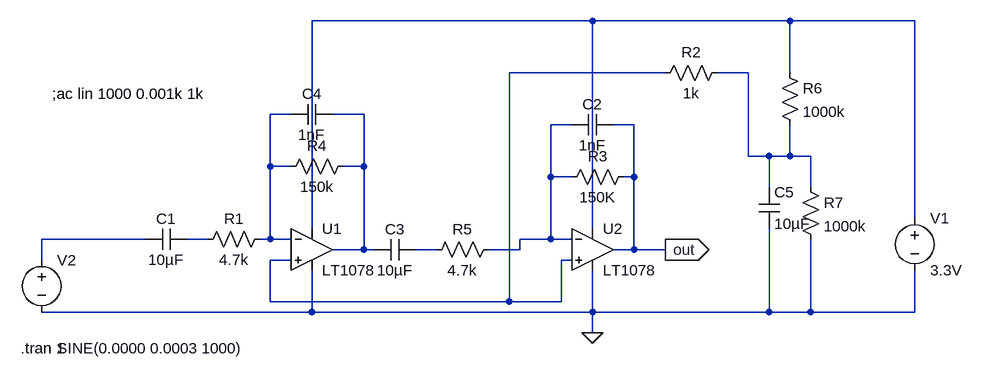
[diagram p0: schematic NFOpAmp.asc]
NFOpAmp.asc, the LTspice schematic file:
Version 4
SHEET 1 980 680
WIRE 400 -256 -32 -256
WIRE 704 -256 400 -256
WIRE 896 -256 704 -256
WIRE 512 -176 272 -176
WIRE 640 -176 592 -176
WIRE 704 -176 704 -256
WIRE -64 -112 -96 -112
WIRE 48 -112 0 -112
WIRE 368 -96 336 -96
WIRE 464 -96 432 -96
WIRE 640 -48 640 -176
WIRE 672 -48 640 -48
WIRE 704 -48 704 -96
WIRE 704 -48 672 -48
WIRE 736 -48 704 -48
WIRE -96 -32 -96 -112
WIRE -64 -32 -96 -32
WIRE 48 -32 48 -112
WIRE 48 -32 16 -32
WIRE 336 -16 336 -96
WIRE 368 -16 336 -16
WIRE 464 -16 464 -96
WIRE 464 -16 448 -16
WIRE 672 0 672 -48
WIRE 736 0 736 -48
WIRE 896 48 896 -256
WIRE -32 64 -32 -256
WIRE 400 64 400 -256
WIRE -320 80 -448 80
WIRE -288 80 -320 80
WIRE -192 80 -224 80
WIRE -96 80 -96 -32
WIRE -96 80 -112 80
WIRE -64 80 -96 80
WIRE 336 80 336 -16
WIRE 336 80 288 80
WIRE 368 80 336 80
WIRE 48 96 48 -32
WIRE 48 96 0 96
WIRE 64 96 48 96
WIRE 160 96 128 96
WIRE 288 96 288 80
WIRE 288 96 240 96
WIRE 464 96 464 -16
WIRE 464 96 432 96
WIRE 512 96 464 96
WIRE -448 112 -448 80
WIRE -64 112 -96 112
WIRE 368 112 352 112
WIRE -96 176 -96 112
WIRE 272 176 272 -176
WIRE 272 176 -96 176
WIRE 352 176 352 112
WIRE 352 176 272 176
WIRE -32 192 -32 128
WIRE -32 192 -448 192
WIRE 400 192 400 128
WIRE 400 192 -32 192
WIRE 672 192 672 64
WIRE 672 192 400 192
WIRE 736 192 736 80
WIRE 736 192 672 192
WIRE 896 192 896 128
WIRE 896 192 736 192
WIRE 400 224 400 192
FLAG 400 224 0
FLAG 512 96 out
IOPIN 512 96 Out
DATAFLAG -320 80 ""
SYMBOL voltage 896 32 R0
WINDOW 123 0 0 Left 2
WINDOW 39 0 0 Left 2
SYMATTR InstName V1
SYMATTR Value 3.3V
SYMBOL res -96 64 R90
WINDOW 0 0 56 VBottom 2
WINDOW 3 32 56 VTop 2
SYMATTR InstName R1
SYMATTR Value 4.7k
SYMBOL cap -224 64 R90
WINDOW 0 0 32 VBottom 2
WINDOW 3 32 32 VTop 2
SYMATTR InstName C1
SYMATTR Value 10µF
SYMBOL res 464 -32 R90
WINDOW 0 0 56 VBottom 2
WINDOW 3 32 56 VTop 2
SYMATTR InstName R3
SYMATTR Value 150K
SYMBOL cap 432 -112 R90
WINDOW 0 0 32 VBottom 2
WINDOW 3 32 32 VTop 2
SYMATTR InstName C2
SYMATTR Value 1nF
SYMBOL res 32 -48 R90
WINDOW 0 0 56 VBottom 2
WINDOW 3 32 56 VTop 2
SYMATTR InstName R4
SYMATTR Value 150k
SYMBOL cap 128 80 R90
WINDOW 0 0 32 VBottom 2
WINDOW 3 32 32 VTop 2
SYMATTR InstName C3
SYMATTR Value 10µF
SYMBOL res 256 80 R90
WINDOW 0 0 56 VBottom 2
WINDOW 3 32 56 VTop 2
SYMATTR InstName R5
SYMATTR Value 4.7k
SYMBOL cap 0 -128 R90
WINDOW 0 0 32 VBottom 2
WINDOW 3 32 32 VTop 2
SYMATTR InstName C4
SYMATTR Value 1nF
SYMBOL voltage -448 96 R0
WINDOW 123 24 124 Left 2
WINDOW 39 0 0 Left 2
WINDOW 3 24 152 Left 2
SYMATTR Value SINE(0.0000 0.0003 1000)
SYMATTR InstName V2
SYMBOL Opamps\\LT1078 -32 32 R0
SYMATTR InstName U1
SYMBOL Opamps\\LT1078 400 32 R0
SYMATTR InstName U2
SYMBOL res 688 -192 R0
SYMATTR InstName R6
SYMATTR Value 1000k
SYMBOL res 720 -16 R0
SYMATTR InstName R7
SYMATTR Value 1000k
SYMBOL cap 656 0 R0
SYMATTR InstName C5
SYMATTR Value 10µF
SYMBOL res 608 -192 R90
WINDOW 0 0 56 VBottom 2
WINDOW 3 32 56 VTop 2
SYMATTR InstName R2
SYMATTR Value 1k
TEXT -480 248 Left 2 !.tran 1
TEXT -432 -144 Left 2 !;ac lin 1000 0.001k 1k

The netlist it stands for:
* NFOpAmp.asc
V1 N001 0 3.3V
R1 N004 N008 4.7k
C1 N008 N007 10µF
R3 out N006 150K
C2 out N006 1nF
R4 N005 N004 150k
C3 N009 N005 10µF
R5 N006 N009 4.7k
C4 N005 N004 1nF
V2 N007 0 SINE(0.0000 0.0003 1000)
XU1 N002 N004 N001 0 N005 LT1078  ; pins In+ In- V+ V- OUT
XU2 N002 N006 N001 0 out LT1078  ; pins In+ In- V+ V- OUT
R6 N001 N003 1000k
R7 N003 0 1000k
C5 N003 0 10µF
R2 N003 N002 1k
.tran 1
;ac lin 1000 0.001k 1k
.backanno
.end